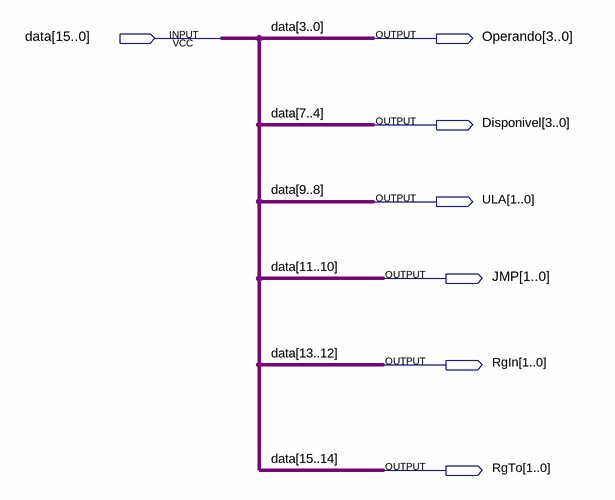
[diagram p0: schematic sheet]
// Quartus schematic extract.bdf as structural Verilog: 0 symbols, 7 pins
module extract (
  input  [15:0] data,
  output [3:0] Operando,
  output [3:0] Disponivel,
  output [1:0] ULA,
  output [1:0] JMP,
  output [1:0] RgIn,
  output [1:0] RgTo
);


  assign Disponivel = data[7:4];
  assign JMP = data[11:10];
  assign Operando = data[3:0];
  assign RgIn = data[13:12];
  assign RgTo = data[15:14];
  assign ULA = data[9:8];
endmodule
